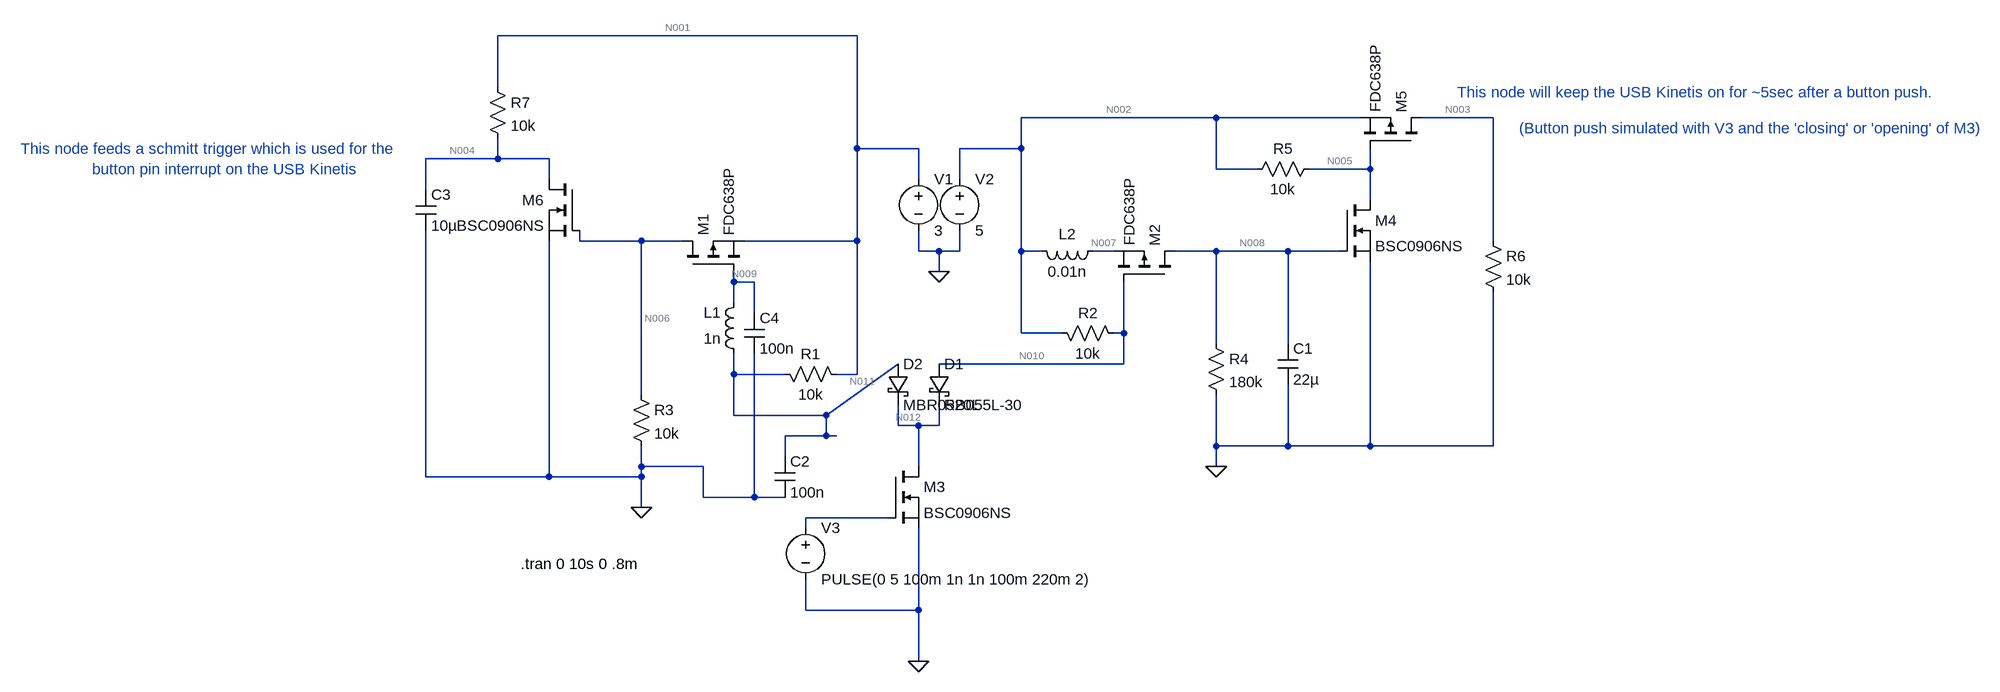
[diagram p0: schematic DualSpstFunctionCircuit.asc]
DualSpstFunctionCircuit.asc, the LTspice schematic file:
Version 4
SHEET 1 1892 680
WIRE 96 -544 -464 -544
WIRE -464 -464 -464 -544
WIRE 656 -416 352 -416
WIRE 880 -416 656 -416
WIRE 1088 -416 976 -416
WIRE 96 -368 96 -544
WIRE 192 -368 96 -368
WIRE 352 -368 352 -416
WIRE 352 -368 256 -368
WIRE -464 -352 -464 -384
WIRE -464 -352 -576 -352
WIRE -384 -352 -464 -352
WIRE 656 -336 656 -416
WIRE 720 -336 656 -336
WIRE 896 -336 896 -368
WIRE 896 -336 800 -336
WIRE -384 -320 -384 -352
WIRE 192 -320 192 -368
WIRE 256 -320 256 -368
WIRE -576 -304 -576 -352
WIRE 896 -288 896 -336
WIRE -336 -224 -336 -240
WIRE -240 -224 -336 -224
WIRE -176 -224 -240 -224
WIRE 96 -224 96 -368
WIRE 96 -224 -80 -224
WIRE 1088 -224 1088 -416
WIRE 192 -208 192 -240
WIRE 224 -208 192 -208
WIRE 256 -208 256 -240
WIRE 256 -208 224 -208
WIRE 352 -208 352 -368
WIRE 384 -208 352 -208
WIRE 496 -208 464 -208
WIRE 656 -208 592 -208
WIRE 768 -208 656 -208
WIRE 848 -208 768 -208
WIRE 224 -176 224 -208
WIRE -96 -160 -96 -176
WIRE -64 -160 -96 -160
WIRE -96 -128 -96 -160
WIRE -64 -112 -64 -160
WIRE 352 -80 352 -208
WIRE 416 -80 352 -80
WIRE 512 -80 512 -160
WIRE 512 -80 496 -80
WIRE 656 -64 656 -208
WIRE 768 -64 768 -208
WIRE 512 -32 512 -80
WIRE 512 -32 224 -32
WIRE -96 -16 -96 -48
WIRE -16 -16 -96 -16
WIRE 96 -16 96 -224
WIRE 96 -16 64 -16
WIRE -240 16 -240 -224
WIRE -96 48 -96 -16
WIRE 48 48 160 -32
WIRE 48 48 -96 48
WIRE 160 64 160 32
WIRE 192 64 160 64
WIRE 224 64 224 32
WIRE 224 64 192 64
WIRE 48 80 48 48
WIRE 48 80 -16 80
WIRE 64 80 48 80
WIRE 656 96 656 16
WIRE 768 96 768 0
WIRE 768 96 656 96
WIRE 896 96 896 -192
WIRE 896 96 768 96
WIRE 1088 96 1088 -144
WIRE 1088 96 896 96
WIRE -16 112 -16 80
WIRE -240 128 -240 96
WIRE -144 128 -240 128
WIRE 192 128 192 64
WIRE 656 128 656 96
WIRE -576 144 -576 -240
WIRE -384 144 -384 -224
WIRE -384 144 -576 144
WIRE -240 144 -240 128
WIRE -240 144 -384 144
WIRE -144 176 -144 128
WIRE -64 176 -64 -48
WIRE -64 176 -144 176
WIRE -16 176 -64 176
WIRE -240 192 -240 144
WIRE 144 208 16 208
WIRE 16 224 16 208
WIRE 16 352 16 304
WIRE 192 352 192 224
WIRE 192 352 16 352
WIRE 192 432 192 352
FLAG 192 432 0
FLAG 224 -176 0
FLAG -240 192 0
FLAG 656 128 0
SYMBOL schottky 208 -32 R0
SYMATTR InstName D1
SYMATTR Value RB055L-30
SYMBOL schottky 144 -32 R0
SYMATTR InstName D2
SYMATTR Value MBR0520L
SYMBOL pmos -176 -176 R270
SYMATTR InstName M1
SYMATTR Value FDC638P
SYMBOL pmos 592 -160 M270
SYMATTR InstName M2
SYMATTR Value FDC638P
SYMBOL res -32 -32 M90
WINDOW 0 0 56 VBottom 2
WINDOW 3 32 56 VTop 2
SYMATTR InstName R1
SYMATTR Value 10k
SYMBOL res 400 -96 M90
WINDOW 0 0 56 VBottom 2
WINDOW 3 32 56 VTop 2
SYMATTR InstName R2
SYMATTR Value 10k
SYMBOL voltage 192 -336 R0
WINDOW 123 0 0 Left 2
WINDOW 39 0 0 Left 2
SYMATTR InstName V1
SYMATTR Value 3
SYMBOL voltage 256 -336 R0
WINDOW 123 0 0 Left 2
WINDOW 39 0 0 Left 2
SYMATTR InstName V2
SYMATTR Value 5
SYMBOL res -256 0 R0
SYMATTR InstName R3
SYMATTR Value 10k
SYMBOL res 640 -80 R0
SYMATTR InstName R4
SYMATTR Value 180k
SYMBOL voltage 16 208 R0
WINDOW 123 0 0 Left 2
WINDOW 39 0 0 Left 2
SYMATTR InstName V3
SYMATTR Value PULSE(0 5 100m 1n 1n 100m 220m 2)
SYMBOL ind 480 -224 R90
WINDOW 0 5 56 VBottom 2
WINDOW 3 32 56 VTop 2
SYMATTR InstName L2
SYMATTR Value 0.01n
SYMBOL cap 752 -64 R0
SYMATTR InstName C1
SYMATTR Value 22µ
SYMBOL nmos 144 128 R0
SYMATTR InstName M3
SYMATTR Value BSC0906NS
SYMBOL nmos 848 -288 R0
SYMATTR InstName M4
SYMATTR Value BSC0906NS
SYMBOL pmos 976 -368 M270
SYMATTR InstName M5
SYMATTR Value FDC638P
SYMBOL res 816 -352 R90
WINDOW 0 0 56 VBottom 2
WINDOW 3 32 56 VTop 2
SYMATTR InstName R5
SYMATTR Value 10k
SYMBOL res 1072 -240 R0
SYMATTR InstName R6
SYMATTR Value 10k
SYMBOL cap -32 112 R0
SYMATTR InstName C2
SYMATTR Value 100n
SYMBOL nmos -336 -320 M0
SYMATTR InstName M6
SYMATTR Value BSC0906NS
SYMBOL cap -592 -304 R0
SYMATTR InstName C3
SYMATTR Value 10µ
SYMBOL res -480 -480 R0
SYMATTR InstName R7
SYMATTR Value 10k
SYMBOL ind -80 -32 R180
WINDOW 0 36 80 Left 2
WINDOW 3 36 40 Left 2
SYMATTR InstName L1
SYMATTR Value 1n
SYMBOL cap -80 -112 R0
SYMATTR InstName C4
SYMATTR Value 100n
TEXT -428 280 Left 2 !.tran 0 10s 0 .8m
TEXT 1032 -456 Left 2 ;This node will keep the USB Kinetis on for ~5sec after a button push.
TEXT 1128 -400 Left 2 ;(Button push simulated with V3 and the 'closing' or 'opening' of M3)
TEXT -1208 -368 Left 2 ;This node feeds a schmitt trigger which is used for the
TEXT -1096 -336 Left 2 ;button pin interrupt on the USB Kinetis

The netlist it stands for:
* DualSpstFunctionCircuit.asc
D1 N010 N012 RB055L-30
D2 N011 N012 MBR0520L
M1 N006 N009 N001 N001 FDC638P
M2 N008 N010 N007 N007 FDC638P
R1 N011 N001 10k
R2 N002 N010 10k
V1 N001 0 3
V2 N002 0 5
R3 N006 0 10k
R4 N008 0 180k
V3 N013 0 PULSE(0 5 100m 1n 1n 100m 220m 2)
L2 N007 N002 0.01n
C1 N008 0 22µ
M3 N012 N013 0 0 BSC0906NS
M4 N005 N008 0 0 BSC0906NS
M5 N003 N005 N002 N002 FDC638P
R5 N005 N002 10k
R6 N003 0 10k
C2 N011 0 100n
M6 N004 N006 0 0 BSC0906NS
C3 N004 0 10µ
R7 N001 N004 10k
L1 N011 N009 1n
C4 N009 0 100n
.model D D
.lib standard.dio
.model NMOS NMOS
.model PMOS PMOS
.lib standard.mos
.tran 0 10s 0 .8m
* This node will keep the USB Kinetis on for ~5sec after a button push.
* (Button push simulated with V3 and the 'closing' or 'opening' of M3)
* This node feeds a schmitt trigger which is used for the
* button pin interrupt on the USB Kinetis
.backanno
.end

* Results of the author's LTspice run, read from the files saved beside the schematic
* Operating Point, zero values left out:
*   V(n010) = 4.999 V
*   V(n012) = 4.997 V
*   V(n011) = 3.001 V
*   V(n006) = 411.8 nV
*   V(n009) = 3.001 V
*   V(n001) = 3 V
*   V(n008) = 8.315 µV
*   V(n007) = 5 V
*   V(n002) = 5 V
*   V(n005) = 5 V
*   V(n003) = 456.8 nV
*   V(n004) = 3 V
*   Id(M6) = 12.46 pA
*   Is(M6) = -12.46 pA
*   Id(M4) = 14.47 pA
*   Is(M4) = -14.47 pA
*   Id(M3) = 14.47 pA
*   Is(M3) = -14.47 pA
*   Id(M5) = -40.68 pA
*   Is(M5) = 40.68 pA
*   Id(M2) = -41.19 pA
*   Is(M2) = 41.19 pA
*   Id(M1) = -38.18 pA
*   Is(M1) = 38.18 pA
*   I(D2) = -82.5 nA
*   I(D1) = 82.52 nA
*   I(L2) = -46.19 pA
*   I(R7) = 15.65 pA
*   I(R6) = 45.68 pA
*   I(R5) = -20.16 pA
*   I(R4) = 46.19 pA
*   I(R3) = 41.18 pA
*   I(R2) = 82.52 nA
*   I(R1) = 82.5 nA
*   I(V2) = -82.63 nA
*   I(V1) = 82.44 nA
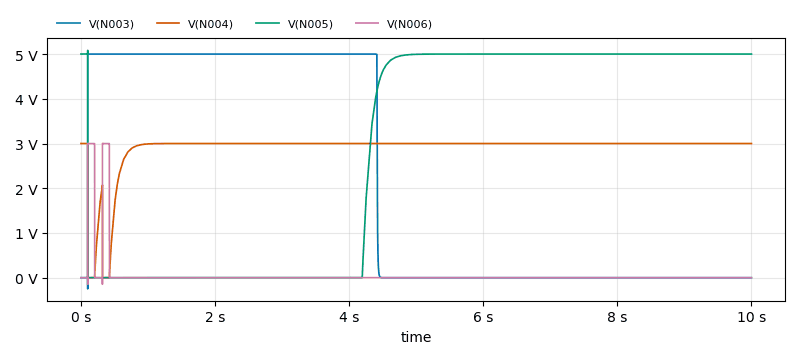
[diagram p1: Transient Analysis of DualSpstFunctionCircuit.asc, plotted from the saved traces]
* Transient Analysis, 1 run:
*   V(N003): min -248.5 mV, max 5 V, average 2.16 V, rms 3.285 V, last 0 V
*   V(N004): min 3.236 µV, max 3 V, average 2.887 V, rms 2.932 V, last 3 V
*   V(N005): min 2.367 µV, max 5.082 V, average 2.891 V, rms 3.783 V, last 5 V
*   V(N006): min -157.3 mV, max 3.001 V, average 61.63 mV, rms 429.8 mV, last 411.8 nV